# EAGLE design lol-v2 (EAGLE 5.10)
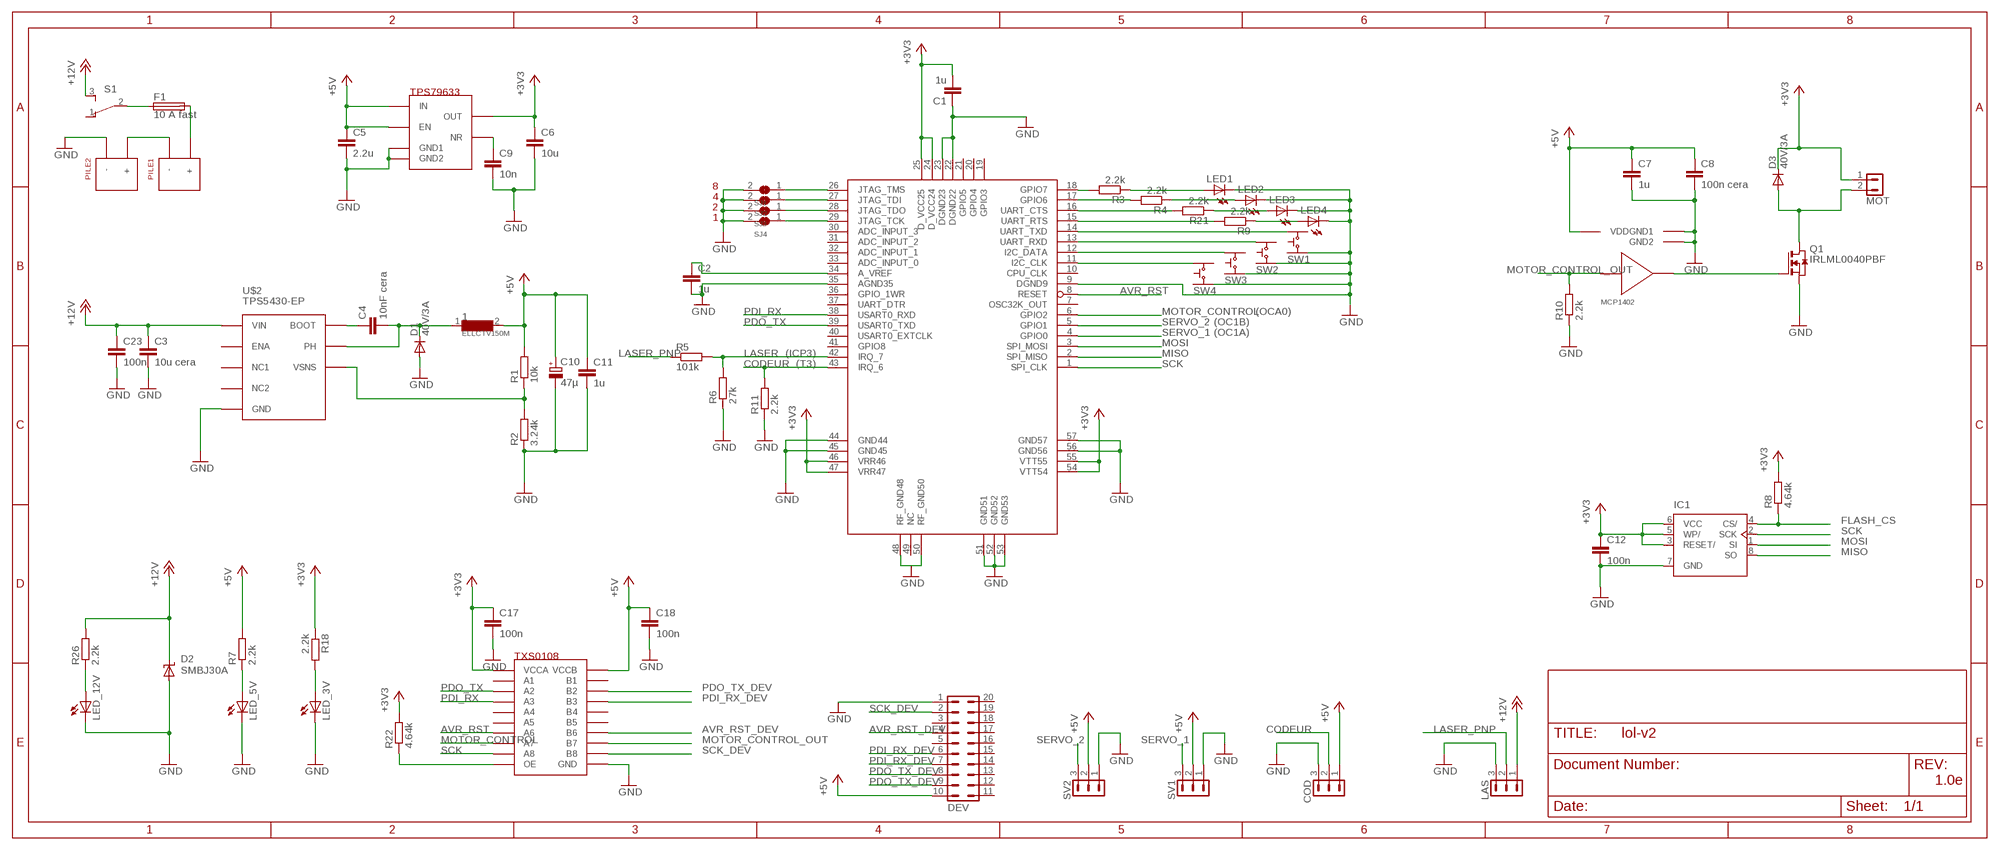
[diagram p0: schematic, sheet 1]

## Parts
1  ELLCTV150M  [ELLCTV150M]
C1  1u  C-EUC0603  [C0603]
C2  1u  C-EUC0603  [C0603]
C3  10u cera  C-EUC1210  [C1210]
C4  10nF cera  C-EUC0603  [C0603]
C5  2.2u  C-EUC0805  [C0805]
C6  10u  C-EUC1210  [C1210]
C7  1u  C-EUC0603  [C0603]
C8  100n cera  C-EUC0603  [C0603]
C9  10n  C-EUC0603  [C0603]
C10  47µ  CPOL-EUC  [PANASONIC_C]
C11  1u  C-EUC0603  [C0603]
C12  100n  C-EUC0603  [C0603]
C17  100n  C-EUC0603  [C0603]
C18  100n  C-EUC0603  [C0603]
C23  100n  C-EUC0603  [C0603]
COD  B3B  [B3B_ZR_SM4]
D1  40V/3A  DIODE-SMB  [SMB]
D2  SMBJ30A  SUPPRESSOR-SMBJ  [SMBJ]
D3  40V/3A  DIODE-SMB  [SMB]
DEV  FTSH-110  [FTSH-110-01-L-DV]
F1  10 A fast  FUSE0448  [0448]
IC1  AT45DB  [SOIC8]
LAS  B3B  [B3B_ZR_SM4]
LED1  LEDSMT1206  [1206]
LED2  LEDSMT1206  [1206]
LED3  LEDSMT1206  [1206]
LED4  LEDSMT1206  [1206]
LED_3V  LEDSMT1206  [1206]
LED_5V  LEDSMT1206  [1206]
LED_12V  LEDSMT1206  [1206]
MOT  B2B  [B2B_ZR_SM4]
PILE1  SUPPORT_PILE  [SUPPORT_PILE]
PILE2  SUPPORT_PILE  [SUPPORT_PILE]
Q1  IRLML0040PBF  [SOT23]
R1  10k  R-EU_R0603  [R0603]
R2  3.24k  R-EU_R0603  [R0603]
R3  2.2k  R-EU_R0603  [R0603]
R4  2.2k  R-EU_R0603  [R0603]
R5  101k  R-EU_R0603  [R0603]
R6  27k  R-EU_M0805  [M0805]
R7  2.2k  R-EU_R0603  [R0603]
R8  4.64k  R-EU_R0603  [R0603]
R9  2.2k  R-EU_R0603  [R0603]
R10  2.2k  R-EU_M0805  [M0805]
R11  2.2k  R-EU_M0805  [M0805]
R18  2.2k  R-EU_R0603  [R0603]
R21  2.2k  R-EU_R0603  [R0603]
R22  4.64k  R-EU_R0603  [R0603]
R26  2.2k  R-EU_R0603  [R0603]
S1  MSS3112D  [MSS3115D]
SJ1  SJ1SMD  [SJ1-SMD]
SJ2  SJ1SMD  [SJ1-SMD]
SJ3  SJ1SMD  [SJ1-SMD]
SJ4  SJ1SMD  [SJ1-SMD]
SV1  B3B  [B3B_ZR_SM4]
SV2  B3B  [B3B_ZR_SM4]
SW1  SKQGAFE010  [SKQGAFE010]
SW2  SKQGAFE010  [SKQGAFE010]
SW3  SKQGAFE010  [SKQGAFE010]
SW4  SKQGAFE010  [SKQGAFE010]
U2  TPS79633  [SOT223-5]
U3  TXS0108  [TSSOP20]
U6  MCP1402  [SOT23-5]
U$1  ATZB-24-UFLR  [ATZB-A24-UFLR]
U$2  TPS5430-EP  [TPS5430-EP]

## Nets
+3V3: C1.2 C6.1 C12.1 C17.1 D3.C IC1.3(RESET/) IC1.5(WP/) IC1.6(VCC) MOT.1 R8.2 R18.1 R22.2 U2.4(OUT) U3.2(VCCA) U$1.24(D_VCC24) U$1.25(D_VCC25) U$1.46(VRR46) U$1.47(VRR47) U$1.54(VTT54) U$1.55(VTT55)
+5V: 1.2 C5.1 C7.1 C8.1 C10.+ C11.1 C18.1 COD.1 DEV.10 R1.2 R7.2 SV1.2 SV2.2 U2.1(EN) U2.2(IN) U3.19(VCCB) U6.2(VDD)
+12V: C3.1 C23.1 D2.C LAS.1 R26.2 S1.3 U$2.P$7(VIN)
AVR_RST: U3.7(A6) U$1.8(RESET)
AVR_RST_DEV: DEV.4 U3.14(B6)
CODEUR: COD.2 R11.2 U$1.43(IRQ_6)
FLASH_CS: IC1.4(CS/) R8.1
GND [supply]: C1.1 C2.2 C3.2 C5.2 C6.2 C7.2 C8.2 C9.2 C10.- C11.2 C12.2 C17.2 C18.2 C23.2 COD.3 D1.A D2.A DEV.1 IC1.7(GND) LAS.3 LED1.C LED2.C LED3.C LED4.C LED_3V.C LED_5V.C LED_12V.C PILE2.- Q1.2(S) R2.1 R6.1 R10.1 R11.1 SJ1.2 SJ2.2 SJ3.2 SJ4.2 SV1.1 SV2.1 SW1.4 SW2.4 SW3.4 SW4.4 U2.3(GND1) U2.6(GND2) U3.11(GND) U6.1(GND1) U6.4(GND2) U$1.9(DGND9) U$1.22(DGND22) U$1.23(DGND23) U$1.35(AGND35) U$1.44(GND44) U$1.45(GND45) U$1.48(RF_GND48) U$1.50(RF_GND50) U$1.51(GND51) U$1.52(GND52) U$1.53(GND53) U$1.56(GND56) U$1.57(GND57) U$2.P$6(GND)
LASER: R5.2 R6.2 U$1.42(IRQ_7)
LASER_PNP: LAS.2 R5.1
MISO: IC1.8(SO) U$1.2(SPI_MISO)
MOSI: IC1.1(SI) U$1.3(SPI_MOSI)
MOTOR_CONTROL: U3.8(A7) U$1.6(GPIO2)
MOTOR_CONTROL_OUT: R10.2 U3.13(B7) U6.3(IN)
N$1: C9.1 U2.5(NR)
N$2: R3.2 U$1.18(GPIO7)
N$3: C4.1 U$2.P$1(BOOT)
N$4: 1.1 C4.2 D1.C U$2.P$8(PH)
N$5: R1.1 R2.2 U$2.P$4(VSNS)
N$6: LED1.A R3.1
N$7: D3.A MOT.2 Q1.3(D)
N$8: Q1.1(G) U6.5(OUT)
N$9: LED2.A R4.1
N$10: R4.2 U$1.17(GPIO6)
N$11: R9.2 U$1.15(UART_RTS)
N$12: LED4.A R9.1
N$13: SW2.1 U$1.13(UART_RXD)
N$14: SJ1.1 U$1.26(JTAG_TMS)
N$15: SJ2.1 U$1.27(JTAG_TDI)
N$16: SJ3.1 U$1.28(JTAG_TDO)
N$17: SJ4.1 U$1.29(JTAG_TCK)
N$18: SW1.1 U$1.14(UART_TXD)
N$19: PILE1.- PILE2.+
N$20: LED_3V.A R18.2
N$21: C2.1 U$1.34(A_VREF)
N$22: F1.P$1 S1.2
N$23: R21.2 U$1.16(UART_CTS)
N$24: LED3.A R21.1
N$25: R22.1 U3.10(OE)
N$26: F1.P$2 PILE1.+
N$27: SW3.1 U$1.12(I2C_DATA)
N$28: SW4.1 U$1.11(I2C_CLK)
NHLED: LED_12V.A R26.1
NPWLED: LED_5V.A R7.1
PDI_RX: U3.4(A3) U$1.38(USART0_RXD)
PDI_RX_DEV: DEV.6 DEV.7 U3.17(B3)
PDO_TX: U3.3(A2) U$1.39(USART0_TXD)
PDO_TX_DEV: DEV.8 DEV.9 U3.18(B2)
SCK: IC1.2(SCK) U3.9(A8) U$1.1(SPI_CLK)
SCK_DEV: DEV.2 U3.12(B8)
SERVO_1: SV1.3 U$1.4(GPIO0)
SERVO_2: SV2.3 U$1.5(GPIO1)
Unconnected: DEV.3 DEV.5 DEV.11 DEV.12 DEV.13 DEV.14 DEV.15 DEV.16 DEV.17 DEV.18 DEV.19 DEV.20 S1.1 SW1.2 SW1.3 SW2.2 SW2.3 SW3.2 SW3.3 SW4.2 SW4.3 U3.1(A1) U3.5(A4) U3.6(A5) U3.15(B5) U3.16(B4) U3.20(B1) U$1.7(OSC32K_OUT) U$1.10(CPU_CLK) U$1.19(GPIO3) U$1.20(GPIO4) U$1.21(GPIO5) U$1.30(ADC_INPUT_3) U$1.31(ADC_INPUT_2) U$1.32(ADC_INPUT_1) U$1.33(ADC_INPUT_0) U$1.36(GPIO_1WR) U$1.37(UART_DTR) U$1.40(USART0_EXTCLK) U$1.41(GPIO8) U$1.49(NC) U$2.P$2(NC1) U$2.P$3(NC2) U$2.P$5(ENA)

## Notes on the sheet
- 8
- 4
- 2
- 1
- IRLML0040PBF
- (OCA0)
- (OC1B)
- (OC1A)
- (ICP3)
- (T3)
- 1.0e

## Library data of the parts
1 = apbteam_rcl:ELLCTV150M: Panasonic ELLCTV150M Inductor Created by florent@duchon.cc
C1-C9 C11 C12 C17 C18 C23 = rcl:C-EU: CAPACITOR, European symbol
C10 = rcl:CPOL-EU: POLARIZED CAPACITOR, European symbol
COD LAS SV1 SV2 = apbteam-con-jst:B3B: JST B3B connector Created by florent@duchon.cc
D1 D3 = diode:DIODE-: DIODE
D2 = diode:SUPPRESSOR-: Suppressor diode
DEV = apbteam-con-samtec:FTSH-110: Samtec FTSH-110 connector Created by florent@duchon.cc
F1 = apbteam_fuse:FUSE: FUSE
IC1 = ni-flash:AT45DB: AT45DB Atmel SPI data flash serie
LED1-LED4 LED_3V LED_5V LED_12V = led:LED: LED OSRAM: - CHIPLED LG R971, LG N971, LY N971, LG Q971, LY Q971, LO R971, LY R971 LH N974, LH R974 LS Q976, LO Q976, LY Q976 LO Q996 - Hyper CHIPLED LW Q18S LB Q993, LB Q99A, LB R99A - SideLED LS A670, LO A670, LY A670, LG A670, LP A670 LB A673, LV A673, LT A673, LW A673 LH A674 LY A675 LS A676, LA A676, LO A676, LY A676, LW A676 LS A679, LY A679, LG A679 - Hyper Micro SIDELED® LS Y876, LA Y876, LO Y876, LY Y876 LT Y87S - SmartLED LW L88C, LW L88S LB L89C, LB L89S, LG L890 LS L89K, LO L89K, LY L89K LS L896, LA L896, LO L896, LY L896 - TOPLED LS T670, LO T670, LY T670, LG T670, LP T670 LSG T670, LSP T670, LSY T670, LOP T670, LYG T670 LG T671, LOG T671, LSG T671 LB T673, LV T673, LT T673, LW T673 LH T674 LS T676, LA T676, LO T676, LY T676, LB T676, LH T676, LSB T676, LW T676 LB T67C, LV T67C, LT T67C, LS T67K, LO T67K, LY T67K, LW E67C LS E67B, LA E67B, LO E67B, LY E67B, LB E67C, LV E67C, LT E67C LW T67C LS T679, LY T679, LG T679 LS T770, LO T770, LY T770, LG T770, LP T770 LB T773, LV T773, LT T773, LW T773 LH T774 LS E675, LA E675, LY E675, LS T675 LS T776, LA T776, LO T776, LY T776, LB T776 LHGB T686 LT T68C, LB T68C - Hyper Mini TOPLED® LB M676 - Mini TOPLED Santana® LG M470 LS M47K, LO M47K, LY M47K Source: http://www.osram.convergy.de - LUMILED® LXK2-PW12-R00, LXK2-PW12-S00, LXK2-PW14-U00, LXK2-PW14-V00 LXK2-PM12-R00, LXK2-PM12-S00, LXK2-PM14-U00 LXK2-PE12-Q00, LXK2-PE12-R00, LXK2-PE12-S00, LXK2-PE14-T00, LXK2-PE14-U00 LXK2-PB12-K00, LXK2-PB12-L00, LXK2-PB12-M00, LXK2-PB14-N00, LXK2-PB14-P00, LXK2-PB14-Q00 LXK2-PR12-L00, LXK2-PR12-M00, LXK2-PR14-Q00, LXK2-PR14-R00 LXK2-PD12-Q00, LXK2-PD12-R00, LXK2-PD12-S00 LXK2-PH12-R00, LXK2-PH12-S00 LXK2-PL12-P00, LXK2-PL12-Q00, LXK2-PL12-R00 Source: www.luxeon.com
MOT = apbteam-con-jst:B2B: JST B2B connector Created by florent@duchon.cc
PILE1 PILE2 = apbteam_beacon-meca:SUPPORT_PILE: Keystone Coupleur Pile 9V PP3 Created by florent@duchon.cc ref RS : 172-5996
Q1 = zigbit:IRLML0040PBF: MOS FET
R1-R11 R18 R21 R22 R26 = rcl:R-EU_: RESISTOR, European symbol
S1 = apbteam_switch:MSS3112D: KNITTER-SWITCH ON-ON Created by florent@duchon.cc ref RS : 711-8423
SJ1-SJ4 = apbteam_jumper:SJ1: Jumper
SW1-SW4 = apbteam_switch:SKQGAFE010: ALPS SKQGAFE010 Switch Created by florent@duchon.cc
U2 = zigbit:TPS79633
U3 = zigbit:TXS0108
U6 = zigbit:MCP1402
U$1 = apbteam_zigbit:ATZB-24-UFLR: ATZB-24-UFLR Package (External Antenna / UFLR connector) Created by florent@duchon.cc
U$2 = apbTeam:TPS5430-EP

## Net classes
1 supply: width 0.254 mm

## Board
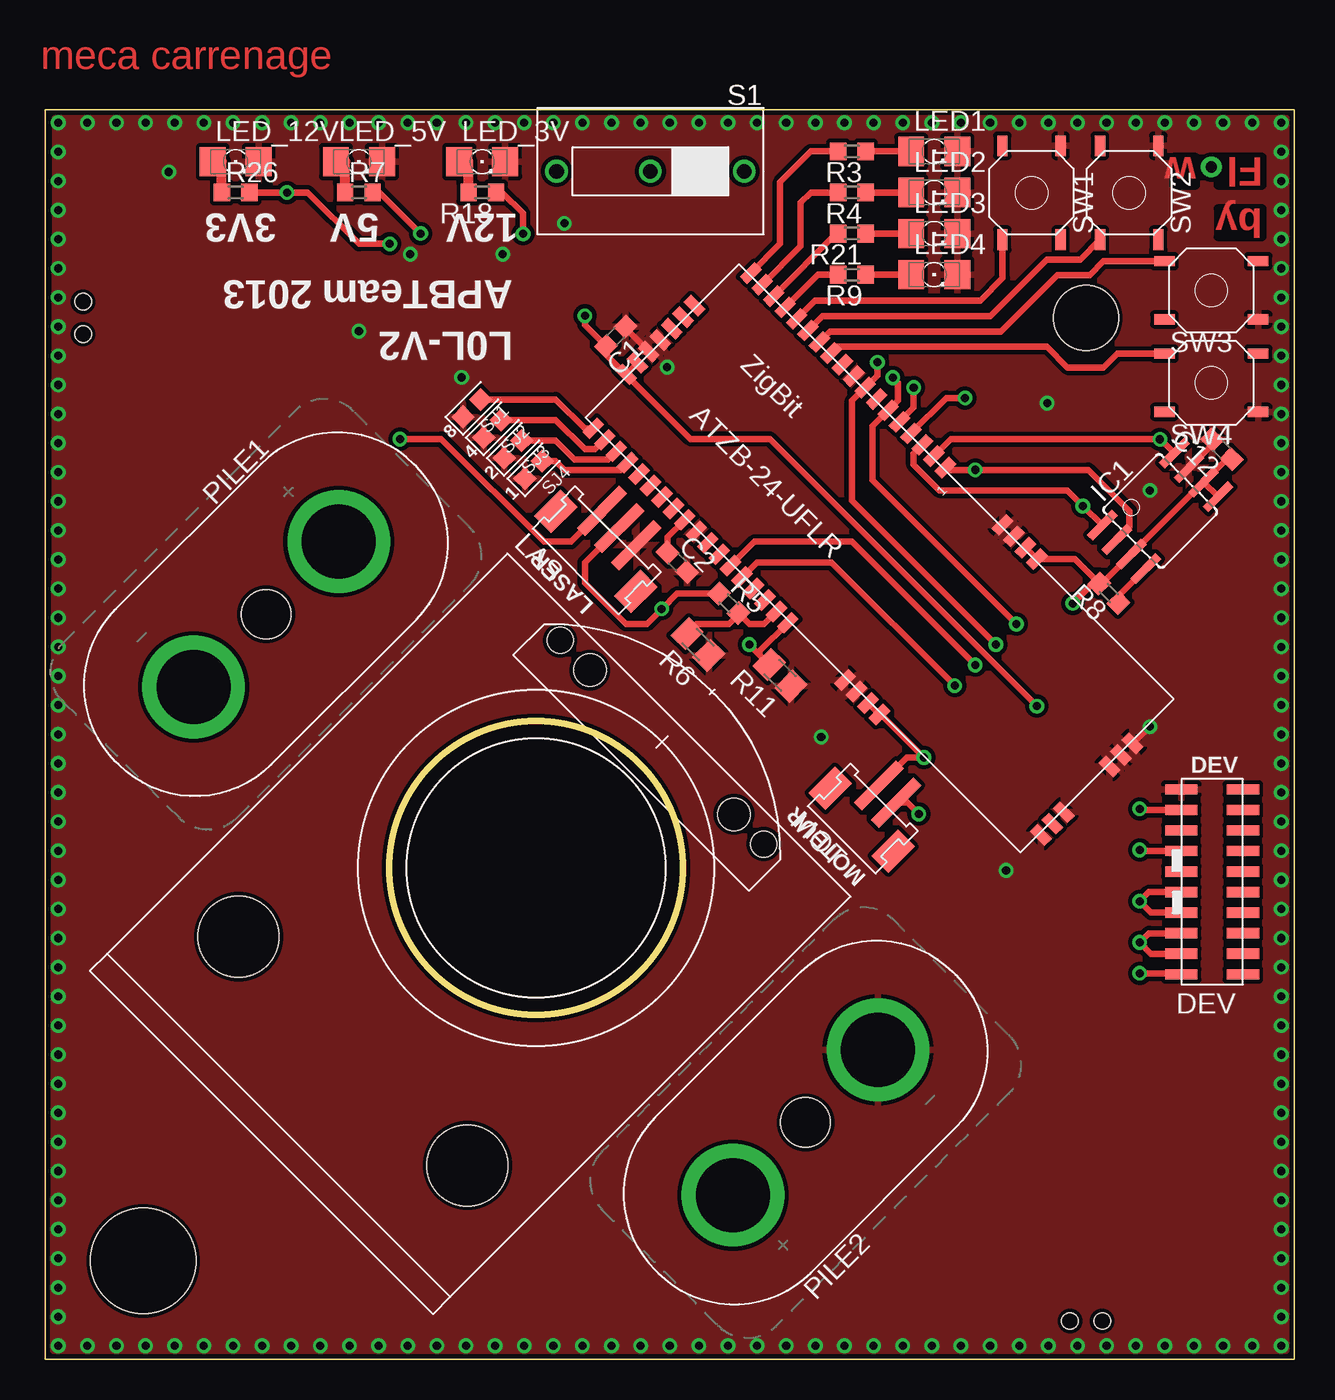
[diagram p1: board, top side]
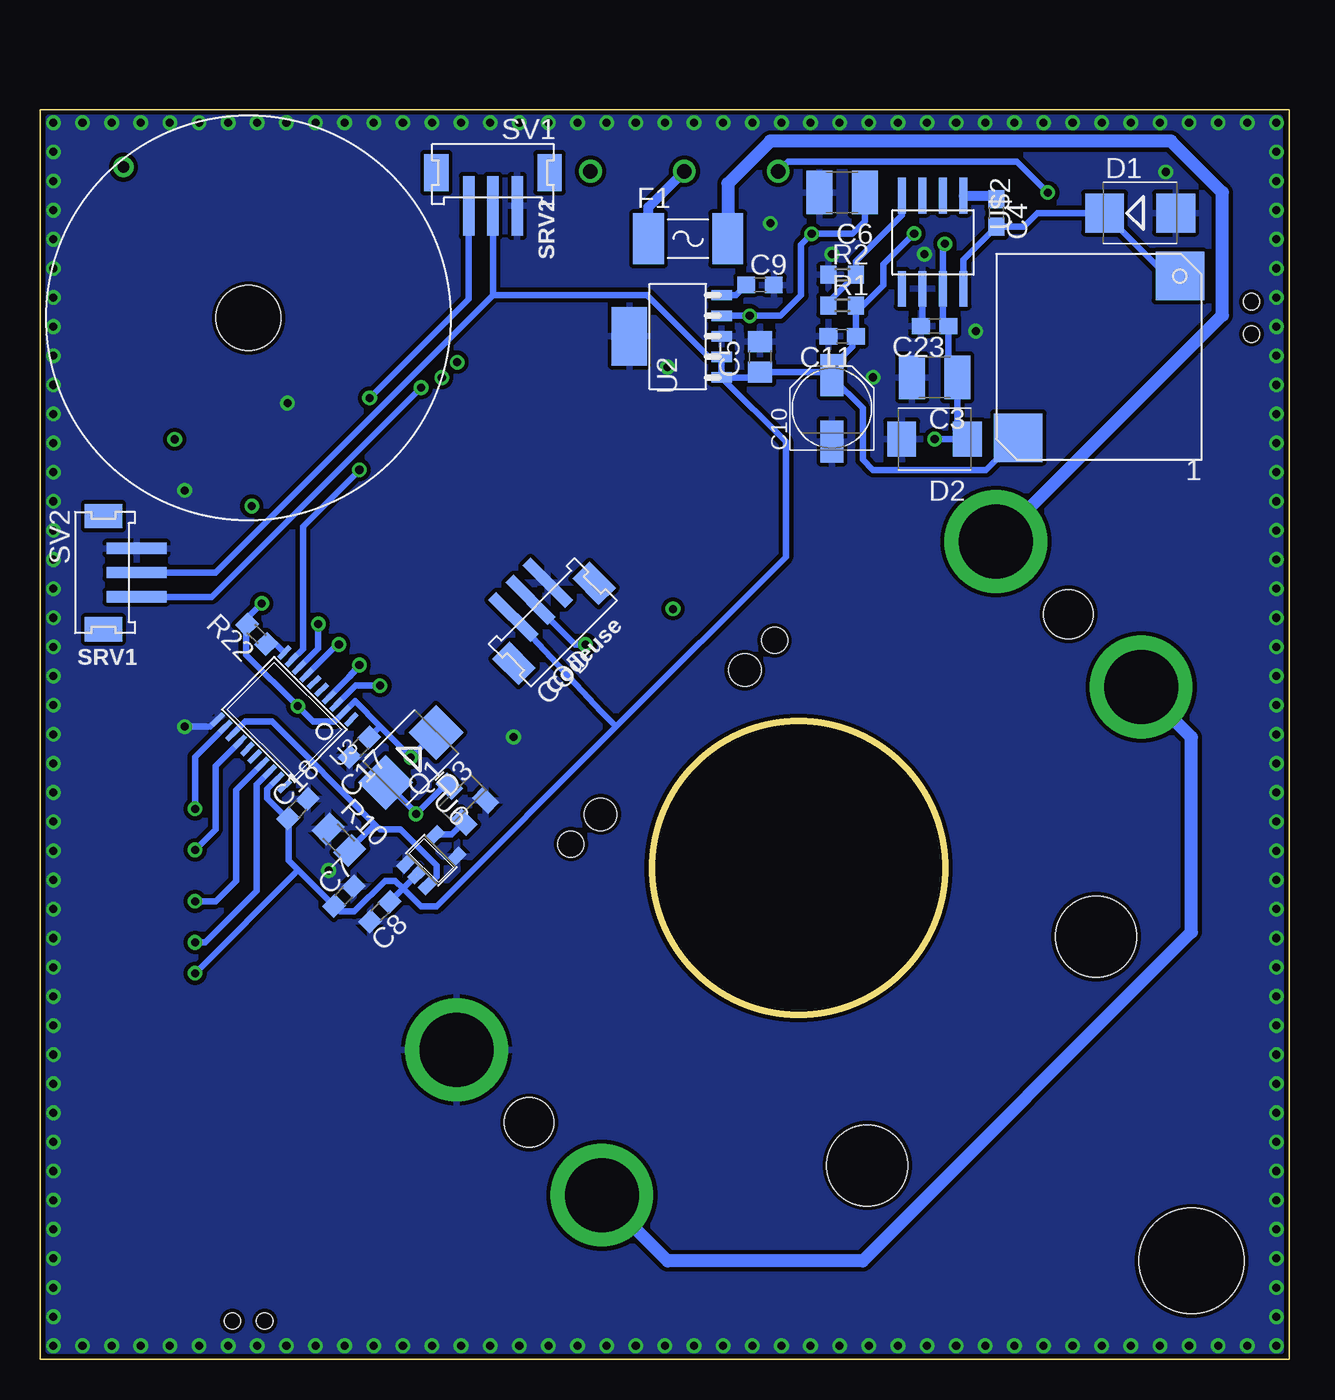
[diagram p2: board, bottom side, seen from below]

Size 77.2 x 77.22 mm. Coordinates in mm from the lower left corner, seen from the top.
Outline: 0,0 0,77.22 77.2,77.22 77.2,0 0,0
Outline: circle at 30.34,30.35 radius 9.06
Copper layers (1*16): Top 0.035mm / dielectric 1.5mm / Bottom 0.035mm
Design rules "Dipole-electronique": minimum track width 0.2mm, minimum drill 0.5mm, track to track 0.2mm, track to pad 0.2mm, pad to pad 0.2mm, via to via 0.2mm, smd to smd 0.2mm, copper to edge 0.2mm, drill to drill 8mil, minimum pad ring 10mil, minimum via ring 8mil, stop-mask expansion 4mil, vias tented up to drill 0mil, thermal gap 10mil
Holes 1 mm at 2.33,65.35 2.33,63.35 63.34,2.35 65.33,2.35
Holes 6.5 mm at 6.05,6.07

### Footprints (pad centres in the part's own frame; a part is rotated, then mirrored left to right if it is on the bottom)
ELLCTV150M = smd 3 x 3: 1 -5,-5; 2 5,5
C0603 = smd 1.1 x 1: 1 -0.85,0; 2 0.85,0
C1210 = smd 1.6 x 2.7: 1 -1.4,0; 2 1.4,0
C0805 = smd 1.3 x 1.5: 1 -0.95,0; 2 0.95,0
PANASONIC_C = smd 2.6 x 1.4: + 2.05,0; - -2.05,0
B3B_ZR_SM4 = smd 0.7 x 3.7: 1 -1.5,2.1; 2 0,2.1; 3 1.5,2.1 | smd 1.5 x 2.3: 4 -3.5,0.05; 5 3.5,0.05
SMB = smd 2.4 x 2.4: A 2.2,0; C -2.2,0
SMBJ = smd 1.78 x 2.16: A 2.04,0; C -2.03,0
FTSH-110-01-L-DV = smd 2 x 0.635: 1 -1.87,5.65; 2 -1.87,4.38; 3 -1.87,3.11; 4 -1.87,1.84; 5 -1.87,0.57; 6 -1.87,-0.7; 7 -1.87,-1.97; 8 -1.87,-3.24; 9 -1.87,-4.51; 10 -1.87,-5.78; 11 1.94,-5.78; 12 1.94,-4.51; 13 1.94,-3.24; 14 1.94,-1.97; 15 1.94,-0.7; 16 1.94,0.57; 17 1.94,1.84; 18 1.94,3.11; 19 1.94,4.38; 20 1.94,5.65
0448 = smd 1.9 x 3.15: P$1 -2.45,0; P$2 2.45,0
SOIC8 = smd 0.5 x 2.2: 1 -1.905,-3.154; 2 -0.645,-3.154; 3 0.625,-3.154; 4 1.895,-3.154; 5 1.905,3.154; 6 0.635,3.154; 7 -0.635,3.154; 8 -1.905,3.154
1206 = smd 1.6 x 1.803: A -1.422,0; C 1.422,0
B2B_ZR_SM4 = smd 0.7 x 3.7: 1 -0.75,2.2; 2 0.75,2.2 | smd 1.5 x 2.3: 3 -2.75,-0.05; 4 2.75,-0.05
SUPPORT_PILE = drill 4.572 pad 6.35 round: + -6.35,0; - 6.35,0 | hole 3.048: 0,0
SOT23 = smd 1 x 1.4: 1 -0.95,-1.1; 2 0.95,-1.1; 3 0,1.1
R0603 = smd 1 x 1.1: 1 -0.85,0; 2 0.85,0
M0805 = smd 1.3 x 1.6: 1 -0.95,0; 2 0.95,0
MSS3115D = drill 0.9 pad 1.3 round: 1 -5.8,0; 2 0,0; 3 5.8,0
SJ1-SMD = smd 1.016 x 1.016: 1 0.762,0; 2 -0.762,0
SKQGAFE010 = smd 1.27 x 0.635: 1 -2.9,1.8; 2 2.9,1.8; 3 -2.9,-1.8; 4 2.9,-1.8
SOT223-5 = smd 0.635 x 1.27: 1 -2.54,-2.7; 2 -1.27,-2.7; 3 0,-2.7; 4 1.27,-2.7; 5 2.54,-2.7 | smd 3.6 x 2.2: 6 0,3
TSSOP20 = smd 0.305 x 0.991: 1 -2.925,-2.918; 2 -2.275,-2.918; 3 -1.625,-2.918; 4 -0.975,-2.918; 5 -0.325,-2.918; 6 0.325,-2.918; 7 0.975,-2.918; 8 1.625,-2.918; 9 2.275,-2.918; 10 2.925,-2.918; 11 2.925,2.918; 12 2.275,2.918; 13 1.625,2.918; 14 0.975,2.918; 15 0.325,2.918; 16 -0.325,2.918; 17 -0.975,2.918; 18 -1.625,2.918; 19 -2.275,2.918; 20 -2.925,2.918
SOT23-5 = smd 0.69 x 0.99: 1 -0.95,-1.29; 2 0,-1.29; 3 0.95,-1.29; 4 0.95,1.3; 5 -0.95,1.3
ATZB-A24-UFLR = smd 0.635 x 1.27: 1 17.9,0.135; 2 16.9,0.135; 3 15.9,0.135; 4 14.9,0.135; 5 13.9,0.135; 6 12.9,0.135; 7 11.9,0.135; 8 10.9,0.135; 9 9.9,0.135; 10 8.9,0.135; 11 7.9,0.135; 12 6.9,0.135; 13 5.9,0.135; 14 4.9,0.135; 15 3.9,0.135; 16 2.9,0.135; 17 1.9,0.135; 18 0.9,0.135; 26 0.8,-13.535; 27 1.8,-13.535; 28 2.8,-13.535; 29 3.8,-13.535; 30 4.8,-13.535; 31 5.8,-13.535; 32 6.8,-13.535; 33 7.8,-13.535; 34 8.8,-13.535; 35 9.8,-13.535; 36 10.8,-13.535; 37 11.8,-13.535; 38 12.8,-13.535; 39 13.8,-13.535; 40 14.8,-13.535; 41 15.8,-13.535; 42 16.8,-13.535; 43 17.8,-13.535; 44 22.8,-13.535; 45 23.8,-13.535; 46 24.8,-13.535; 47 25.8,-13.535; 54 25.9,0.135; 55 24.9,0.135; 56 23.9,0.135; 57 22.9,0.135 | smd 1.27 x 0.635: 19 -0.135,-3.75; 20 -0.135,-4.75; 21 -0.135,-5.75; 22 -0.135,-6.75; 23 -0.135,-7.75; 24 -0.135,-8.75; 25 -0.135,-9.75; 48 38.135,-11.75; 49 38.135,-10.75; 50 38.135,-9.75; 51 38.135,-5.75; 52 38.135,-4.75; 53 38.135,-3.75
TPS5430-EP = smd 2.2 x 0.5: P$1 -0.88,4.39; P$2 -0.88,3.12; P$3 -0.88,1.85; P$4 -0.88,0.58; P$5 4.87,0.58; P$6 4.87,1.85; P$7 4.87,3.12; P$8 4.87,4.39
ACCOUPLEMENT = hole 4: 0,0
BLOC_AXE_ROTATION = hole 5: -10,16; 10,16
AEDB-9140 = hole 2: -11,6.3; -11,-6.3 | hole 1.6: -11,8.9; -11,-8.9

### Placement (x,y rotation side)
1  11.77,61.95 180 bottom
C1  35.26,63.22 225 top
C2  39.07,49.25 315 top
C3  21.93,60.68 180 bottom
C4  18.11,70.84 270 bottom
C5  32.72,61.95 90 bottom
C6  27.64,72.11 180 bottom
C7  58.44,28.61 45 bottom
C8  56.22,27.66 225 bottom
C9  32.72,66.39 0 bottom
C10  28.27,58.77 90 bottom
C11  27.64,63.22 180 bottom
C12  72.72,56.23 135 top
C17  57.48,37.82 225 bottom
C18  61.3,34.01 45 bottom
C23  21.93,63.85 180 bottom
COD  45.42,45.44 45 bottom
D1  9.22,70.84 0 bottom
D2  21.93,56.87 180 bottom
D3  54.31,37.18 225 bottom
DEV  72.09,29.56 0 top
F1  37.16,69.25 0 bottom
IC1  68.92,52.42 315 top
LAS  33.99,49.88 315 top
LED1  54.95,74.65 0 top
LED2  54.95,72.11 0 top
LED3  54.95,69.57 0 top
LED4  54.95,67.03 0 top
LED_3V  27,74.01 0 top
LED_5V  19.39,74.01 0 top
LED_12V  11.77,74.01 0 top
MOT  50.5,33.37 315 top
PILE1  13.65,46.03 225 top
PILE2  46.99,14.62 45 top
Q1  51.13,34.64 45 bottom
R1  27.64,65.12 0 bottom
R2  27.64,67.03 0 bottom
R3  49.87,74.65 180 top
R4  49.87,72.11 180 top
R5  42.24,46.71 315 top
R6  40.34,44.17 135 top
R7  19.39,72.11 0 top
R8  65.74,47.34 135 top
R9  49.87,67.03 180 top
R10  58.76,32.1 315 bottom
R11  45.42,42.26 135 top
R18  27,72.11 180 top
R21  49.87,69.57 180 top
R22  63.84,44.8 135 bottom
R26  11.77,72.11 0 top
S1  37.4,73.42 180 top
SJ1  26.37,58.77 45 top
SJ2  27.64,57.5 45 top
SJ3  28.91,56.23 45 top
SJ4  30.18,54.96 45 top
SV1  49.23,73.38 180 bottom
SV2  73.36,48.61 270 bottom
SW1  60.96,72.09 90 top
SW2  66.99,72.09 90 top
SW3  72.07,66.06 0 top
SW4  72.07,60.34 0 top
U2  37.8,63.22 90 bottom
U3  62.12,39.54 135 bottom
U6  53.04,30.83 315 bottom
U$1  42.88,67.66 315 top
U$2  24.53,71.03 270 bottom
U$3  [ACCOUPLEMENT]  64.33,64.35 0 bottom
U$4  [BLOC_AXE_ROTATION]  30.34,30.35 135 top
U$5  [AEDB-9140]  30.34,30.35 225 top

### Tracks (layer width: path | path; a pad name or v marks a point on that pad's centre or on a via)
+3V3  (via drill 0.5)
  Top 0.406: U$1.25 34.66,62.09 C1.2 33.35,63.92 v33.35,64.49 | U$1.25 U$1.24 | U$1.47 U$1.46 | U$1.47 51.52,39.82 | U$1.55 U$1.54 63.64,49.44 R8.2 | R8.2 65.32,47.94 IC1.3 IC1.6 | 71.86,52.67 IC1.5 IC1.6 | IC1.6 70.94,53.57 | U$1.47 51.64,39.85 v54.31,37.18 53.25,37.18 MOT.1 | 60.66,40.99 | 61.14,40.52 60.66,40.99 | 61.14,40.52 | v61.3,40.36 61.14,40.52 | R8.2 64.75,47.94 v63.52,46.71 | 60.66,40.99 44.78,56.87 39.89,56.87 U$1.25 | v29.53,69.55 29.53,70.82 28.24,72.11 R18.1 | C12.1 73.02,55.63 IC1.6
  Bottom 0.406: U2.4 v33.35,64.49 31.45,64.49 30.18,65.76 30.18,68.9 v29.53,69.55 29.51,69.57 27,69.57 26.24,70.33 C6.1 | D3.C v54.31,37.18 54.31,37.22 56.19,39.11 | 56.19,39.11 57.76,40.67 U3.2 59.03,39.41 60.34,39.41 v61.3,40.36 64.47,43.53 64.47,45.37 R22.2 64.44,45.79 v63.52,46.71 | 56.19,39.11 C17.1
+5V  (via drill 0.5)
  Top 0.406: 70.16,23.85 DEV.10 arc90 70.16,23.85 | v67.64,23.85 70.16,23.85 | v23.2,69.57 20.66,72.11 R7.2
  Bottom 0.406: U2.1 U2.2 35.9,61.95 39.7,65.76 49.23,65.76 | 1.2 18.75,54.96 25.73,54.96 26.37,55.6 26.37,58.77 28.27,60.68 | 33.04,60.68 U2.1 | C11.1 R1.2 26.37,65.12 25.1,66.39 25.1,67.66 v23.2,69.57 | 27,63 27,62.58 28.27,61.31 C10.+ 28.45,61 C5.1 | 49.23,65.76 SV1.2 | 49.23,65.76 66.38,48.61 SV2.2 | COD.1 42.56,40.04 41.61,39.09 | C18.1 61.96,33.41 63.2,34.64 63.2,35.24 U3.19 | C18.1 61.9,33.27 61.93,33.24 | 41.61,39.09 52.72,27.97 53.67,27.97 54.79,29.09 | 61.26,30.23 61.86,30.83 61.86,33.37 C18.1 | 61.26,30.23 v67.64,23.85 | 54.79,29.09 U6.2 | 54.79,29.09 C8.1 | 61.26,30.23 C7.1 58.69,27.66 57.8,27.66 55.9,29.56 55.26,29.56 54.79,29.09 | U2.1 35.26,60.68 | 41.61,39.09 31.13,49.56 31.13,56.71 U2.1
  Bottom 0.61: 28.27,60.68 C10.+ | C5.1 33.04,60.68 | 27,63 C11.1
+12V  (via drill 0.5)
  Top 0.406: v21.29,68.93 19.39,68.93 16.21,72.11 v14.94,72.11 R26.2 | LAS.1 32.5,50.52 30.82,50.52 24.46,56.87 v21.93,56.87
  Bottom 0.406: 20.52,57.5 C3.1 21.07,61.23 C23.1 21.41,64.19 U$2.P$7 21.41,68.81 v21.29,68.93 | S1.3 31,74.01 16.84,74.01 v14.94,72.11 | D2.C v21.93,56.87
  Bottom 0.61: D2.C 20.52,57.5
AVR_RST  (via drill 0.5)
  Top 0.406: v58.76,44.17 49.87,53.06 49.87,59.23 U$1.8 51.44,60.8 v51.44,61.61
  Bottom 0.406: v58.76,44.17 58.86,44.17 U3.7
AVR_RST_DEV  (via drill 0.5)
  Top 0.406: 70.16,31.47 DEV.4 67.71,31.4 v67.64,31.47
  Bottom 0.406: v67.64,31.47 66.38,32.74 66.38,36.66 U3.14
CODEUR  (via drill 0.5)
  Top 0.406: R11.2 44.15,43.53 | 44.15,43.53 v43.52,44.17 | U$1.43 44.15,43.76 44.15,43.53
  Bottom 0.406: v43.52,44.17 44.15,44.17 COD.2
FLASH_CS
  Top 0.406: R8.1 66.34,47.17 IC1.4
GND  (via drill 0.5, 0.5 pad 0.6)
  Top 0.406: C1.1 35.86,63.72 U$1.23 | 67.24,38.05 v68.28,39.09 | C12.2 72.12,56.53 IC1.7
  Bottom 0.406: U3.11 66.7,39.09 v68.28,39.09 | C23.2 22.68,63.85 U$2.P$6
  other vias: 32.09,70.2 28.27,68.3 25.73,60.68 7.64,73.38 59.39,30.2 19.39,63.53 22.56,68.3 38.44,61.31 47.96,38.45 68.28,53.69 61.93,59.09 76.4,76.42 74.6,76.42 72.8,76.42 71,76.42 69.2,76.42 67.4,76.42 65.6,76.42 63.8,76.42 62,76.42 60.2,76.42 58.4,76.42 56.6,76.42 54.8,76.42 53,76.42 51.2,76.42 49.4,76.42 47.6,76.42 45.8,76.42 44,76.42 42.2,76.42 40.4,76.42 38.6,76.42 36.8,76.42 35,76.42 33.2,76.42 31.4,76.42 29.6,76.42 27.8,76.42 26,76.42 24.2,76.42 22.4,76.42 20.6,76.42 18.8,76.42 17,76.42 15.2,76.42 13.4,76.42 11.6,76.42 9.8,76.42 8,76.42 6.2,76.42 4.4,76.42 2.6,76.42 0.8,76.42 76.4,74.62 76.4,72.82 76.4,71.02 76.4,69.22 76.4,67.42 76.4,65.62 76.4,63.82 76.4,62.02 76.4,60.22 76.4,58.42 76.4,56.62 76.4,54.82 76.4,53.02 76.4,51.22 76.4,49.42 76.4,47.62 76.4,45.82 76.4,44.02 76.4,42.22 76.4,40.42 76.4,38.62 76.4,36.82 76.4,35.02 76.4,33.22 76.4,31.42 76.4,29.62 76.4,27.82 76.4,26.02 76.4,24.22 76.4,22.42 76.4,20.62 76.4,18.82 76.4,17.02 76.4,15.22 76.4,13.42 76.4,11.62 76.4,9.82 76.4,8.02 76.4,6.22 76.4,4.42 76.4,2.62 76.4,0.82 0.8,2.62 0.8,4.42 0.8,6.22 0.8,8.02 0.8,9.82 0.8,11.62 0.8,13.42 0.8,15.22 0.8,17.02 0.8,18.82 0.8,20.62 0.8,22.42 0.8,24.22 0.8,26.02 0.8,27.82 0.8,29.62 0.8,31.42 0.8,33.22 0.8,35.02 0.8,36.82 0.8,38.62 0.8,40.42 0.8,42.22 0.8,44.02 0.8,45.82 0.8,47.62 0.8,49.42 0.8,51.22 0.8,53.02 0.8,54.82 0.8,56.62 0.8,58.42 0.8,60.22 0.8,62.02 0.8,63.82 0.8,65.62 0.8,67.42 0.8,69.22 0.8,71.02 0.8,72.82 0.8,74.62 74.6,0.82 72.8,0.82 71,0.82 69.2,0.82 67.4,0.82 65.6,0.82 63.8,0.82 62,0.82 60.2,0.82 58.4,0.82 56.6,0.82 54.8,0.82 53,0.82 51.2,0.82 49.4,0.82 47.6,0.82 45.8,0.82 44,0.82 42.2,0.82 40.4,0.82 38.6,0.82 36.8,0.82 35,0.82 33.2,0.82 31.4,0.82 29.6,0.82 27.8,0.82 26,0.82 24.2,0.82 22.4,0.82 20.6,0.82 18.8,0.82 17,0.82 15.2,0.82 13.4,0.82 11.6,0.82 9.8,0.82 8,0.82 6.2,0.82 4.4,0.82 2.6,0.82 0.8,0.82
  pour Top (isolate 0.254): 0.5,0.52 76.7,0.52 76.7,76.72 0.6,76.72
  pour Bottom (isolate 0.254): 0.5,0.52 76.7,0.52 76.7,76.72 0.6,76.72
LASER
  Top 0.406: U$1.42 44.41,45.44 43.52,45.44 R5.2 42.85,46.04 42.24,45.44 40.27,45.44 R6.2
LASER_PNP  (via drill 0.5)
  Top 0.406: LAS.2 33.35,49.25 33.35,47.98 35.9,45.44 37.18,45.44 v38.11,46.36 | R5.1 39.05,47.31 v38.11,46.36 | v38.1,46.37 | v38.11,46.36 v38.1,46.37
MISO  (via drill 0.5)
  Top 0.406: U$1.2 55.98,56.87 68.9,56.87 | 68.9,56.87 68.93,56.87 IC1.8 | 68.9,56.87 v68.9,56.85
MOSI  (via drill 0.5)
  Top 0.406: 64.14,52.73 63.18,53.69 55.26,53.69 53.67,55.28 53.67,55.97 U$1.3 | 64.14,52.73 IC1.1 | v64.14,52.72 | 64.14,52.73 v64.14,52.72
MOTOR_CONTROL  (via drill 0.5)
  Top 0.406: U$1.6 51.13,57.67 51.13,54.33 v60.02,45.44 | U$1.6 52.39,58.93 | v52.39,60.66 52.7,60.34 52.7,59.24 U$1.6
  Bottom 0.406: U3.8 60.02,43.93 v60.02,45.44
MOTOR_CONTROL_OUT
  Bottom 0.406: U3.13 64.55,39.41 62.88,39.41 56.53,33.06 | 56.53,33.06 56.22,32.74 54.95,32.74 52.72,30.51 52.72,29.81 U6.3 53.04,29.49 | R10.2 58.08,31.5 56.53,33.06
N$1
  Bottom 0.406: C9.1 34.2,65.76 U2.5
N$2
  Top 0.406: U$1.18 45.42,68.93 45.42,72.74 47.33,74.65 R3.2
N$3
  Bottom 0.61: U$2.P$1 18.34,71.91 C4.1
N$4
  Bottom 0.406: 7.54,66.95 D1.C 15.57,70.84 16.43,69.99 C4.2 20.14,67.96 U$2.P$8
  Bottom 0.61: 1.1 7.54,66.95
N$5
  Bottom 0.406: U$2.P$4 23.95,70.72 26.79,67.88 R2.2 28.49,65.33 R1.1
N$6
  Top 0.406: R3.1 LED1.A
N$7  (via drill 0.5)
  Top 0.406: 51.56,33.37 MOT.2 53.28,34.4 v53.99,33.69
  Bottom 0.406: D3.A 53.99,33.75 v53.99,33.69 52.26,35.42 Q1.3
N$8
  Bottom 0.406: U6.5 51.8,32.42 Q1.1
N$9
  Top 0.406: R4.1 LED2.A
N$10
  Top 0.406: U$1.17 46.69,68.79 46.69,71.47 47.33,72.11 R4.2
N$11
  Top 0.406: U$1.15 47.76,67.03 R9.2
N$12
  Top 0.406: R9.1 LED4.A
N$13
  Top 0.406: 47.33,63.85 47.33,63.76 U$1.13 48.03,64.47 58.42,64.47 61.91,67.96 63.97,67.96 SW2.1
N$14
  Top 0.406: U$1.26 33.85,57.5 33.35,57.5 31.55,59.31 SJ1.1
N$15
  Top 0.406: U$1.27 34,56.23 33.35,56.23 31.55,58.04 SJ2.1
N$16
  Top 0.406: U$1.28 34.77,55.6 32.72,55.6 31.55,56.77 SJ3.1
N$17
  Top 0.406: U$1.29 35.55,54.96 32.09,54.96 31.55,55.5 SJ4.1
N$18
  Top 0.406: SW1.1 59.16,66.8 57.78,65.42 47.57,65.42 U$1.14
N$19
  Bottom 0.813: PILE1.- 6.05,38.43 6.05,26.39 26.37,6.07 38.44,6.07 PILE2.+
N$20
  Top 0.61: LED_3V.A 26.16,74.01 R18.2
N$21
  Top 0.406: C2.1 38.47,50.81 U$1.34
N$22
  Bottom 0.61: S1.2 39.62,71.2 F1.P$1
N$23
  Top 0.406: R21.2 48.89,69.57 U$1.16
N$24
  Top 0.406: R21.1 LED3.A
N$25
  Bottom 0.406: U3.10 62.65,44.2 R22.1
N$26
  Bottom 0.813: F1.P$2 34.72,72.65 32.09,75.28 7.32,75.28 4.14,72.11 4.14,64.52 PILE1.+
N$27
  Top 0.406: SW3.1 65.41,67.86 64.56,67.01 62.55,67.01 59.05,63.52 48.49,63.52 U$1.12
N$28
  Top 0.406: U$1.11 48.95,62.56 61.91,62.56 63.18,61.3 65.41,61.3 66.25,62.14 SW4.1
N$29  (via drill 0.7 pad 1.27)
  other vias: 72.07,73.68
NHLED
  Top 0.61: LED_12V.A 10.91,74.01 R26.1
NPWLED
  Top 0.61: LED_5V.A 18.54,74.01 R7.1
PDI_RX  (via drill 0.5)
  Top 0.406: v57.48,42.9 49.87,50.52 43.84,50.52 U$1.38
  Bottom 0.406: U3.4 58.12,42.15 v57.48,42.9
PDI_RX_DEV  (via drill 0.5)
  Top 0.406: 70.22,27.72 DEV.7 68.34,27.59 v67.64,28.29 68.22,28.86 DEV.6
  Bottom 0.406: v67.64,28.29 66.38,28.29 65.11,29.56 65.11,35.17 U3.17
PDO_TX  (via drill 0.5 pad 0.61)
  Top 0.406: U$1.39 43.98,49.25 48.59,49.25 v56.22,41.63
  Bottom 0.406: U3.3 57.73,41.63 v56.22,41.63
PDO_TX_DEV  (via drill 0.5)
  Top 0.406: 70.22,25.18 DEV.9 68.34,25.05 v67.64,25.75 68.22,26.32 DEV.8
  Bottom 0.406: v67.64,25.75 67.01,25.75 63.84,28.93 63.84,35.52 U3.18
SCK  (via drill 0.5)
  Top 0.406: 66.38,50.79 IC1.2 67.01,51.43 67.01,52.42 64.47,54.96 v57.48,54.96 55.77,54.96 U$1.1 55.63,55.02
  Bottom 0.406: U3.9 60.98,43.89 60.98,51.47 v57.48,54.96
SCK_DEV  (via drill 0.5)
  Top 0.406: 70.16,34.01 DEV.2 67.71,33.94 v67.64,34.01
  Bottom 0.406: v67.64,34.01 67.64,37.22 U3.12
SERVO_1  (via drill 0.5)
  Top 0.406: 53.51,57.34 U$1.4 55.7,59.41 v56.85,59.41
  Bottom 0.406: v56.85,59.41 50.73,65.53 SV1.3
SERVO_2  (via drill 0.5)
  Top 0.406: 52.83,57.93 U$1.5 53.67,58.8 v53.67,60.04
  Bottom 0.406: v53.67,60.04 66.61,47.11 SV2.3

### Text on the board
Top: meca carrenage | w | Fl | by
tSilk: 3V3 | 5V | 12V | 2013 | APBTeam | L0L-V2 | 8 | 4 | 2 | 1 | LASER | DEV | MOTEUR
bSilk: SRV2 | SRV1 | Codeuse